# Altium schematic sheet Activity_Recognition_Board_v1.0_Sensor.SchDoc
size A4
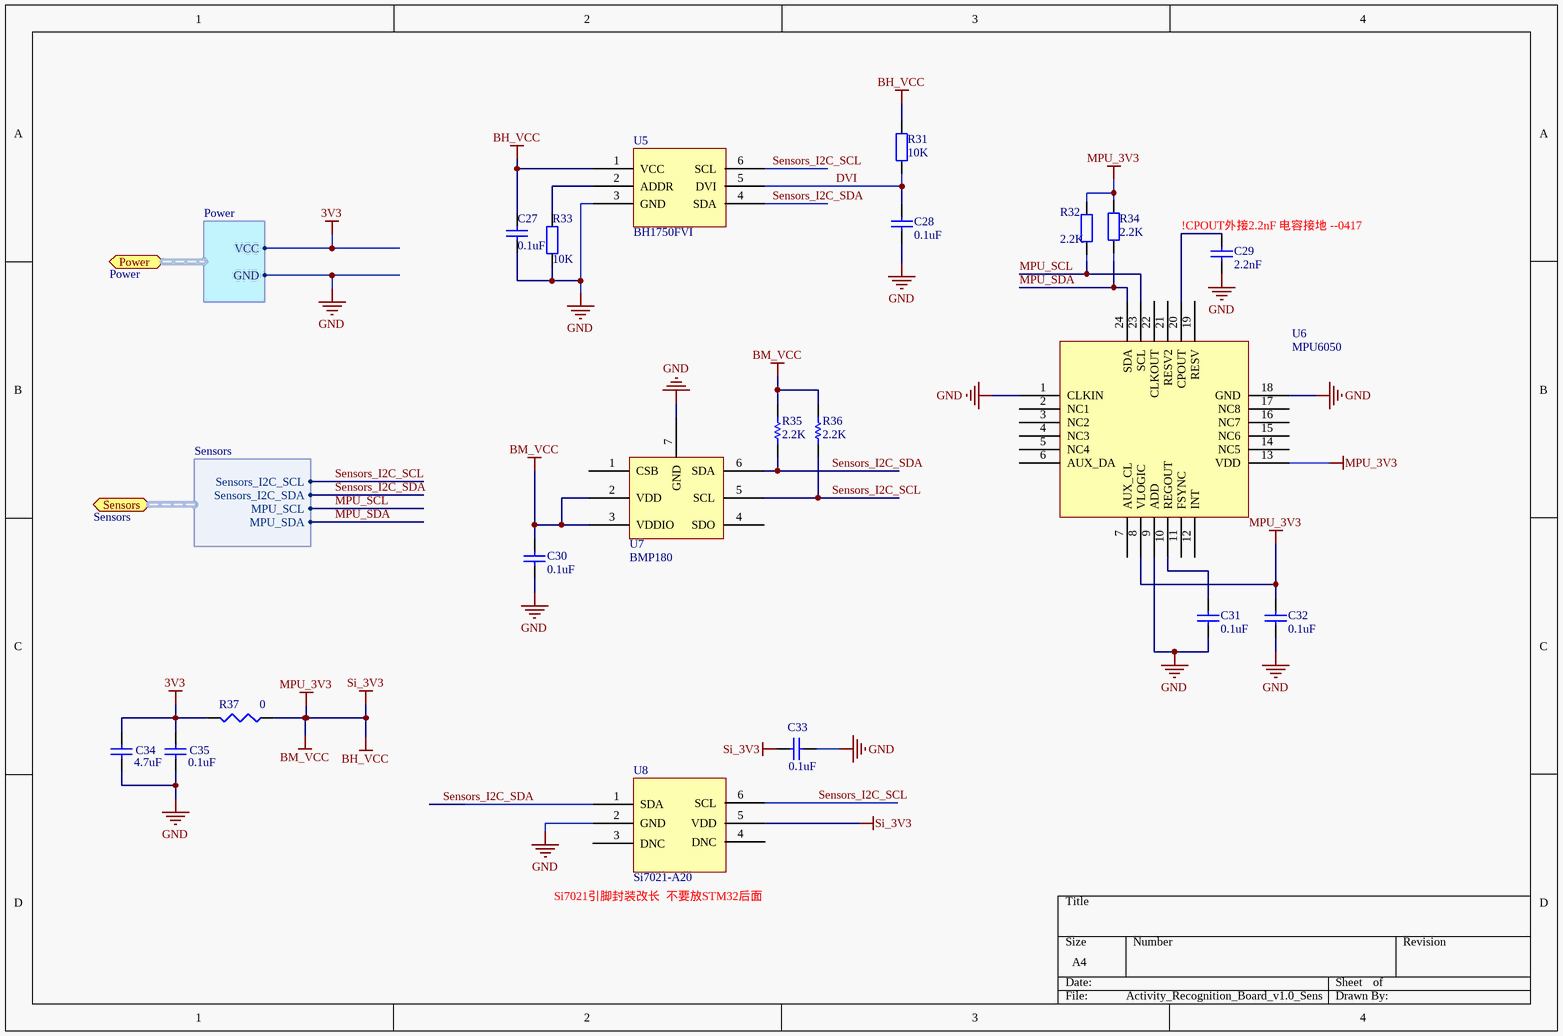
[diagram p0: Activity_Recognition_Board_v1.0_Sensor.SchDoc]

## Parts
C27  value 0.1uF  [C0402]  (hidden comment: Cap semi)
C28  value 0.1uF  [C0402]  (hidden comment: Cap semi)
C29  value 2.2nF  [C0402]  (hidden comment: Cap semi)
C30  value 0.1uF  [C0402]  (hidden comment: Cap semi)
C31  value 0.1uF  [C0402]  (hidden comment: Cap semi)
C32  value 0.1uF  [C0402]  (hidden comment: Cap semi)
C33  value 0.1uF  [C0402]  (hidden comment: Cap semi)
C34  value 4.7uF  [C0603]  (hidden comment: Cap semi)
C35  value 0.1uF  [C0402]  (hidden comment: Cap semi)
R31  value 10K  [R0402]  (hidden comment: Res2)
R32  value 2.2K  [R0402]  (hidden comment: Res2)
R33  value 10K  [R0402]  (hidden comment: Res2)
R34  value 2.2K  [R0402]  (hidden comment: Res2)
R35  value 2.2K  [R0402]  (hidden comment: Res1)
R36  value 2.2K  [R0402]  (hidden comment: Res1)
R37  value 0  [R0402]  (hidden comment: Res3)
U5  BH1750FVI  [WSOF6I]
U6  MPU6050  [QFN-24]
U7  BMP180  [LGA7]
U8  Si7021-A20  [Si7021-A10]

## Ports
Power (harness Power), Sensors (harness Sensors)

## Harnesses
Power: VCC, GND
Sensors: Sensors_I2C_SCL, Sensors_I2C_SDA, MPU_SDA, MPU_SCL

## Nets
3V3: C34.1 C35.1 R37.2 ; port Power.VCC
BH_VCC: C27.2 C30.2 C32.1 C33.2 R31.1 R32.2 R34.2 R35.2 R36.2 R37.1 U5.1(VCC) U6.8(VLOGIC) U6.13(VDD) U7.2(VDD) U7.3(VDDIO) U8.5(VDD)  [also labelled BM_VCC, MPU_3V3, Si_3V3]
GND: C27.1 C28.1 C29.2 C30.1 C31.2 C32.2 C33.1 C34.2 C35.2 R33.2 U5.3(GND) U6.1(CLKIN) U6.9(ADD) U6.18(GND) U7.7(GND) U8.2(GND) ; port Power.GND
DVI: C28.2 R31.2 U5.5(DVI)
MPU_SCL: R32.1 U6.23(SCL) ; port Sensors.MPU_SCL
MPU_SDA: R34.1 U6.24(SDA) ; port Sensors.MPU_SDA
Sensors_I2C_SCL: R36.1 U5.6(SCL) U7.5(SCL) U8.6(SCL) ; port Sensors.Sensors_I2C_SCL
Sensors_I2C_SDA: R35.1 U5.4(SDA) U7.6(SDA) U8.1(SDA) ; port Sensors.Sensors_I2C_SDA
NetC29_1: C29.1 U6.20(CPOUT)
NetC31_1: C31.1 U6.10(REGOUT)
NetR33_1: R33.1 U5.2(ADDR)

Not connected (* = marked no-connect by the designer): U6 2(NC1) 3(NC2) 4(NC3) 5(NC4) 6(AUX_DA) 7(AUX_CL) 11(FSYNC) 12(INT) 14(NC5) 15(NC6) 16(NC7) 17(NC8) 19(RESV) 21(RESV2) 22(CLKOUT); U7 1(CSB) 4(SDO); U8 3(DNC) 4(DNC)

## Notes on the sheet
- (near C29) !CPOUT外接2.2nF 电容接地 --0417
- Labels drawn without touching a wire or pin: Si7021引脚封装改长  不要放STM32后面

## Library data of the parts
C27-C35 = Cap semi: Capacitor (Semiconductor SIM Model); Published: 8-Jun-2000; LatestRevisionDate: 29-May-2009; LatestRevisionNote: IPC-7351 Footprint Added.; PackageReference: C1206; Publisher: Altium Limited; PackageDescription: Chip Capacitor
R31-R34 = Res2: Resistor; Published: 8-Jun-2000; LatestRevisionDate: 17-Jul-2002; LatestRevisionNote: Re-released for DXP Platform.; PackageReference: AXIAL-0.4; Publisher: Altium Limited
R35 R36 = Res1: Resistor; Published: 8-Jun-2000; LatestRevisionDate: 17-Jul-2002; LatestRevisionNote: Re-released for DXP Platform.; PackageReference: AXIAL-0.3; Publisher: Altium Limited
R37 = Res3: Resistor; Published: 8-Jun-2000; LatestRevisionDate: 29-May-2009; LatestRevisionNote: IPC-7351 Footprint Added.; PackageReference: J1-0603; Publisher: Altium Limited; PackageDescription: Chip Resistor